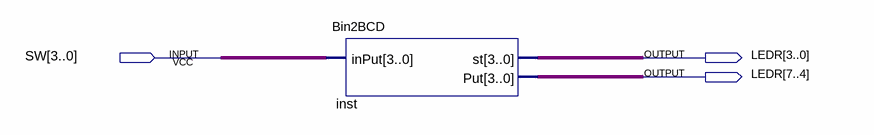
[diagram p0: schematic sheet]
// Quartus schematic prototico.bdf as structural Verilog: 1 symbols, 3 pins
module prototico (
  input  [3:0] SW,
  output [7:0] LEDR
);

  Bin2BCD inst (.inPut(SW), .st(LEDR[3:0]), .Put(LEDR[7:4]));
endmodule
